# EAGLE design due_alternative (EAGLE 9.6.2)
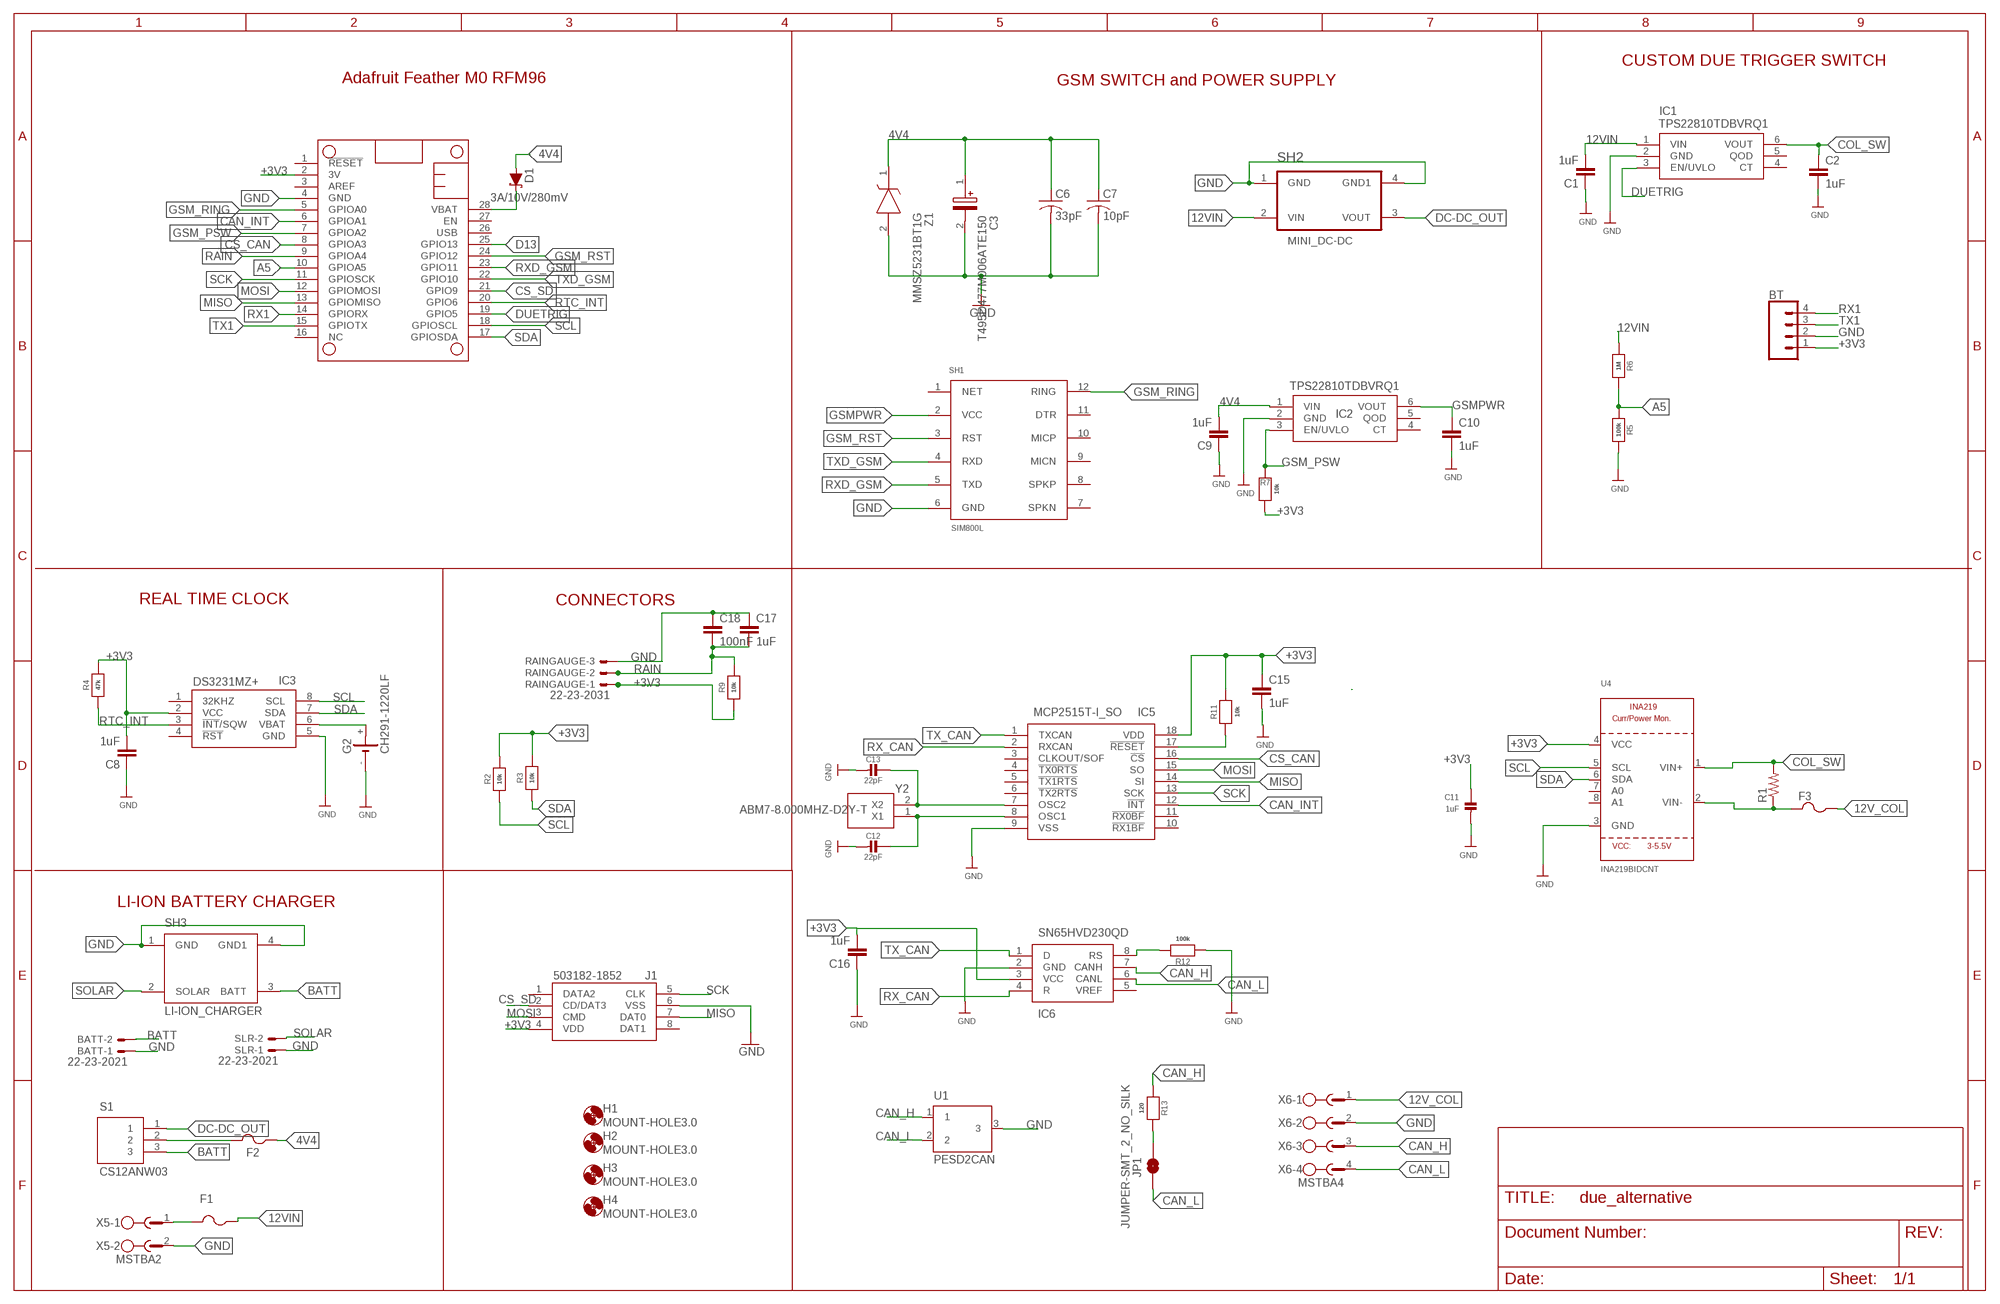
[diagram p0: schematic, sheet 1]

## Parts
BATT  22-23-2021  [22-23-2021]
BT  CONN_04PTH  [1X04]
C1  1uF  CC0603  [C0603]
C2  1uF  CC0603  [C0603]
C3  T495D477M006ATE150  [CAPPM7343X310N]
C6  33pF  C-USC0603  [C0603]
C7  10pF  C-USC0603  [C0603]
C8  1uF  CC0603  [C0603]
C9  1uF  CC0603  [C0603]
C10  1uF  CC0603  [C0603]
C11  1uF  CAP_CERAMIC0603_NO  [0603-NO]
C12  22pF  CAP_CERAMIC0603_NO  [0603-NO]
C13  22pF  CAP_CERAMIC0603_NO  [0603-NO]
C15  1uF  CC0603  [C0603]
C16  1uF  CC0603  [C0603]
C17  1uF  CC0603  [C0603]
C18  100nF  CC0603  [C0603]
D1  3A/10V/280mV  DIODE-SCHOTTKY-BAT60A  [SOD-323]
F1  PTCFUSE-1206  [R1206]
F2  PTCFUSE-1206  [R1206]
F3  PTCFUSE-1206  [R1206]
G2  CH291-1220LF  [CH291-1220LF]
H1  MOUNT-HOLE3.0  [3,0]
H2  MOUNT-HOLE3.0  [3,0]
H3  MOUNT-HOLE3.0  [3,0]
H4  MOUNT-HOLE3.0  [3,0]
IC1  TPS22810TDBVRQ1  [SOT95P280X145-6N]
IC2  TPS22810TDBVRQ1  [SOT95P280X145-6N]
IC3  DS3231MZ+  [SOIC127P600X175-8N]
IC5  MCP2515T-I_SO  [SOIC127P1030X265-18N]
IC6  SN65HVD230QD  [SOIC127P600X175-8N]
J1  503182-1852  [5031821852]
JP1  JUMPER-SMT_2_NO_SILK  [SMT-JUMPER_2_NO_SILK]
MS1  FEATHERWING_NODIM  [FEATHERWING_DIM]
R1  R-US_R6332  [R6332]
R2  10k  RESISTOR_0603_NOOUT  [0603-NO]
R3  10k  RESISTOR_0603_NOOUT  [0603-NO]
R4  47k  RESISTOR_0603_NOOUT  [0603-NO]
R5  100k  RESISTOR_0603_NOOUT  [0603-NO]
R6  1M  RESISTOR_0603_NOOUT  [0603-NO]
R7  10k  RESISTOR_0603_NOOUT  [0603-NO]
R9  10k  RESISTOR_0603_NOOUT  [0603-NO]
R11  10k  RESISTOR_0603_NOOUT  [0603-NO]
R12  100k  RESISTOR_0603_NOOUT  [0603-NO]
R13  120  RESISTOR_0603_NOOUT  [0603-NO]
RAINGAUGE  22-23-2031  [22-23-2031]
S1  CS12ANW03  [CS12ANW03]
SH1  SIM800L  [GSM_SIM800L]
SH2  MINI_DC-DC  [MINI_DC-DC_MP2307DN]
SH3  LI-ION_CHARGER  [LI-ION_CHARGER]
SLR  22-23-2021  [22-23-2021]
U1  PESD2CAN  [SOT23]
U4  INA219BIDCNT  INA219  [SOT23-8]
X5  MSTBA2  [MSTBA2]
X6  MSTBA4  [MSTBA4]
Y2  ABM7-8.000MHZ-D2Y-T  [ABM78000MHZD2YT]
Z1  MMSZ5231BT1G  [SOD3716X135N]

## Nets
4V4: C3.1(+) C6.1 C7.1 C9.2 D1.A F2.1 IC2.1(VIN) Z1.1(K)
12V_COL: F3.1 X6.1
12VIN: C1.2 F1.1 IC1.1(VIN) R6.1 SH2.2(VIN)
+3V3: BT.1 C8.2 C11.1 C15.1 C16.2 IC3.2(VCC) IC5.18(VDD) IC6.3(VCC) J1.4(VDD) MS1.2(3V) R2.2 R3.2 R4.2 R7.1 R9.1 R11.2 RAINGAUGE.1 U4.4(VCC)
A5: MS1.10(GPIOA5) R5.1 R6.2
BATT: BATT.2 S1.3 SH3.3(BATT)
CAN_H: IC6.7(CANH) R13.1 U1.1 X6.3
CAN_INT: IC5.12(!INT) MS1.6(GPIOA1)
CAN_L: IC6.6(CANL) JP1.1 U1.2 X6.4
COL_SW: C2.1 IC1.6(VOUT) R1.2 U4.1(VIN+)
CS_CAN: IC5.16(!CS) MS1.8(GPIOA3)
CS_SD: J1.2(CD/DAT3) MS1.21(GPIO9)
D13: MS1.25(GPIO13)
DC-DC_OUT: S1.1 SH2.3(VOUT)
DUETRIG: IC1.3(EN/UVLO) MS1.19(GPIO5)
GND: BATT.1 BT.2 C1.1 C2.2 C3.2(-) C6.2 C7.2 C8.1 C9.1 C10.2 C11.2 C12.2 C13.2 C15.2 C16.1 C17.1 C18.1 G2.- IC1.2(GND) IC2.2(GND) IC3.5(GND) IC5.9(VSS) IC6.2(GND) J1.6(VSS) MS1.4(GND) R5.2 R12.1 RAINGAUGE.3 SH1.6(GND) SH2.1(GND) SH2.4(GND1) SH3.1(GND) SH3.4(GND1) SLR.1 U1.3 U4.3(GND) X5.2 X6.2 Z1.2(A)
GSM_PSW: IC2.3(EN/UVLO) MS1.7(GPIOA2) R7.2
GSM_RING: MS1.5(GPIOA0) SH1.12(RING)
GSM_RST: MS1.24(GPIO12) SH1.3(RST)
GSMPWR: C10.1 IC2.6(VOUT) SH1.2(VCC)
MISO: IC5.14(SI) J1.7(DAT0) MS1.13(GPIOMISO)
MOSI: IC5.15(SO) J1.3(CMD) MS1.12(GPIOMOSI)
N$1: C12.1 IC5.8(OSC1) Y2.1(X1)
N$2: G2.+ IC3.6(VBAT)
N$3: C13.1 IC5.7(OSC2) Y2.2(X2)
N$4: F1.2 X5.1
N$7: IC6.8(RS) R12.2
N$8: F3.2 R1.1 U4.2(VIN-)
N$10: IC5.17(!RESET) R11.1
N$11: JP1.2 R13.2
N$16: F2.2 S1.2
RAIN: C17.2 C18.2 MS1.9(GPIOA4) R9.2 RAINGAUGE.2
RTC_INT: IC3.3(!INT!/SQW) MS1.20(GPIO6) R4.1
RX1: BT.4 MS1.14(GPIORX)
RX_CAN: IC5.2(RXCAN) IC6.4(R)
RXD_GSM: MS1.23(GPIO11) SH1.5(TXD)
SCK: IC5.13(SCK) J1.5(CLK) MS1.11(GPIOSCK)
SCL: IC3.8(SCL) MS1.18(GPIOSCL) R2.1 U4.5(SCL)
SDA: IC3.7(SDA) MS1.17(GPIOSDA) R3.1 U4.6(SDA)
SOLAR: SH3.2(SOLAR) SLR.2
TX1: BT.3 MS1.15(GPIOTX)
TX_CAN: IC5.1(TXCAN) IC6.1(D)
TXD_GSM: MS1.22(GPIO10) SH1.4(RXD)
VBAT: D1.C MS1.28(VBAT)
Unconnected: IC1.4(CT) IC1.5(QOD) IC2.4(CT) IC2.5(QOD) IC3.1(32KHZ) IC3.4(!RST) IC5.3(CLKOUT/SOF) IC5.4(!TX0RTS) IC5.5(!TX1RTS) IC5.6(!TX2RTS) IC5.10(!RX1BF) IC5.11(!RX0BF) IC6.5(VREF) J1.1(DATA2) J1.8(DAT1) MS1.1(!RESET) MS1.3(AREF) MS1.16(NC) MS1.26(USB) MS1.27(EN) SH1.1(NET) SH1.7(SPKN) SH1.8(SPKP) SH1.9(MICN) SH1.10(MICP) SH1.11(DTR) U4.7(A0) U4.8(A1)

## Notes on the sheet
- CUSTOM DUE TRIGGER SWITCH
- Adafruit Feather M0 RFM96 | GSM SWITCH and POWER SUPPLY
- REAL TIME CLOCK | CONNECTORS
- LI-ION BATTERY CHARGER

## Library data of the parts
BATT SLR = con-molex:22-23-2021: .100" (2.54mm) Center Header - 2 Pin; MF: MOLEX; MPN: 22-23-2021; OC_FARNELL: 1462926; OC_NEWARK: 25C3832
BT = SparkFun-Connectors:CONN_04: Multi connection point. Often used as Generic Header-pin footprint for 0.1 inch spaced/style header connections On any of the 0.1 inch spaced packages, you can populate with these: Break Away Headers - Straight <https://www.sparkfun.com/products/116> (PRT-00116) Break Away Male Headers - Right Angle <https://www.sparkfun.com/products/553> (PRT-00553) Female Headers <https://www.sparkfun.com/products/115> (PRT-00115) Break Away Headers - Machine Pin <https://www.sparkfun.com/products/117> (PRT-00117) Break Away Female Headers - Swiss Machine Pin <https://www.sparkfun.com/products/743> (PRT-00743) For SCREWTERMINALS and SPRING TERMINALS visit here: Screw Terimnals on SparkFun.com <https://www.sparkfun.com/search/results?term=Screw+Terminals> (5mm/3.5mm/2.54mm spacing) This device is also useful as a general connection point to wire up your design to another part of your project. Our various solder wires solder well into these plated through hole pads. Hook-Up Wire - Assortment (Stranded, 22 AWG) <https://www.sparkfun.com/products/11375> (PRT-11375) Hook-Up Wire - Assortment (Solid Core, 22 AWG) <https://www.sparkfun.com/products/11367> (PRT-11367) View the entire wire category on our website here <https://www.sparkfun.com/categories/141> Special notes: Molex polarized connector foot print use with SKU : PRT-08231 with associated crimp pins and housings. 1MM SMD Version SKU: PRT-10208; PROD_ID: CONN-09696
C1 C2 C8-C10 C15-C18 = eagle-ltspice:C: CAPACITOR, European symbol; SPICEMODEL: NONE; SPICEPREFIX: C
C3 = SamacSys_Parts:T495D477M006ATE150: Tantalum Capacitors - Solid SMD 6.3volts 470uF 20% Source: Datasheet <https://componentsearchengine.com/Datasheets/1/T495D477M006ATE150.pdf>; DESCRIPTION: Tantalum Capacitors - Solid SMD 6.3volts 470uF 20%; HEIGHT: 3.1mm; MANUFACTURER_NAME: Kemet; MANUFACTURER_PART_NUMBER: T495D477M006ATE150; MOUSER_PART_NUMBER: 80-T495D477M6ATE150; MOUSER_PRICE-STOCK: https://www.mouser.com/Search/Refine.aspx?Keyword=80-T495D477M6ATE150
C6 C7 = rcl:C-US: CAPACITOR, American symbol; SPICEPREFIX: C
C11-C13 = microbuilder:CAP_CERAMIC: Ceramic Capacitors For new designs, use the packages preceded by an '_' character since they are more reliable: The following footprints should be used on most boards: _0402 - Standard footprint for regular board layouts _0603 - Standard footprint for regular board layouts _0805 - Standard footprint for regular board layouts _1206 - Standard footprint for regular board layouts For extremely tight-pitch boards where space is at a premium, the following 'micro-pitch' footprints can be used (smaller pads, no silkscreen outline, etc.): _0402MP - Micro-pitch footprint for very dense/compact boards _0603MP - Micro-pitch footprint for very dense/compact boards _0805MP - Micro-pitch footprint for very dense/compact boards _1206MP - Micro-pitch footprint for very dense/compact boards
D1 = SparkFun-DiscreteSemi:DIODE-SCHOTTKY: Schottky diode A Schottky diode is a semiconductor diode which has a low forward voltage drop and a very fast switching action.; PROD_ID: DIO-14072
F1-F3 = adafruit:PTCFUSE: PTC fuses, resettable thermistors
G2 = battery:CH291-1220LF: Battery Holder, SMT, 12mm multicomp PART NO. CH291-1220LF Source: Data sheet <http://www.farnell.com/datasheets/1505860.pdf>
H1-H4 = holes:MOUNT-HOLE: MOUNTING HOLE with drill center marker
IC1 IC2 = TPS22810TDBVRQ1:TPS22810TDBVRQ1: Automotive 18V, 2A, 79m Load Switch With Adjustable Rise Time and Adjustable Quick Output Discharge Source: Datasheet <http://www.ti.com/lit/gpn/tps22810-q1>; DESCRIPTION: Automotive 18V, 2A, 79m Load Switch With Adjustable Rise Time and Adjustable Quick Output Discharge; HEIGHT: 1.45mm; MANUFACTURER_NAME: Texas Instruments; MANUFACTURER_PART_NUMBER: TPS22810TDBVRQ1
IC3 = DS3231MZ+:DS3231MZ+: Real Time Clock 5+/-ppm RTC Source: Datasheet <http://uk.rs-online.com/web/p/products/1897249>; DESCRIPTION: Real Time Clock 5+/-ppm RTC; HEIGHT: 1.75mm; MANUFACTURER_NAME: Maxim Integrated; MANUFACTURER_PART_NUMBER: DS3231MZ+; RS_PART_NUMBER: 1897249; RS_PRICE-STOCK: http://uk.rs-online.com/web/p/products/1897249
IC5 = SamacSys_Parts:MCP2515T-I_SO: Microchip Technology MCP2515T-I/SO, CAN Controller 1Mbit/s, 18-Pin SOIC Source: Datasheet <http://ww1.microchip.com/downloads/en/devicedoc/20001801h.pdf>; DESCRIPTION: Microchip Technology MCP2515T-I/SO, CAN Controller 1Mbit/s, 18-Pin SOIC; HEIGHT: 2.65mm; MANUFACTURER_NAME: Microchip; MANUFACTURER_PART_NUMBER: MCP2515T-I/SO; MOUSER_PART_NUMBER: 579-MCP2515T-I/SO; MOUSER_PRICE-STOCK: https://www.mouser.co.uk/ProductDetail/Microchip-Technology/MCP2515T-I-SO?qs=uMUszenkLLKzXVzy0vTLgQ%3D%3D
IC6 = SamacSys_Parts:SN65HVD230QD: 3.3-V CAN Transceiver with Standby Mode Source: Datasheet <https://www.ti.com/lit/ds/symlink/sn65hvd230q-q1.pdf>; ARROW_PART_NUMBER: SN65HVD230QD; ARROW_PRICE-STOCK: https://www.arrow.com/en/products/sn65hvd230qd/texas-instruments; DESCRIPTION: 3.3-V CAN Transceiver with Standby Mode; HEIGHT: 1.75mm; MANUFACTURER_NAME: Texas Instruments; MANUFACTURER_PART_NUMBER: SN65HVD230QD; MOUSER_PART_NUMBER: 595-SN65HVD230QD; MOUSER_PRICE-STOCK: https://www.mouser.co.uk/ProductDetail/Texas-Instruments/SN65HVD230QD/?qs=QViXGNcIEAuXYMZ2FIjwBA%3D%3D
J1 = SamacSys_Parts:503182-1852: Micro SD Normal UltraLowPro8CktEmbsTpPkg Source: Datasheet <https://www.molex.com/pdm_docs/sd/5031821852_sd.pdf>; DESCRIPTION: Micro SD Normal UltraLowPro8CktEmbsTpPkg; HEIGHT: mm; MANUFACTURER_NAME: Molex; MANUFACTURER_PART_NUMBER: 503182-1852; MOUSER_PART_NUMBER: 538-503182-1852; MOUSER_PRICE-STOCK: https://www.mouser.co.uk/ProductDetail/Molex/503182-1852?qs=s7UCm7gO1bZmpyAhCKZ26g%3D%3D
JP1 = SparkFun-Jumpers:JUMPER-SMT_2_NO: Normally open jumper This jumper has two pads in close proximity to each other. Apply solder to close the connection. Round pads are easier to solder for beginners, but are a lot larger. SparkFun Product that uses the round pads: SparkFun EL Sequencer <https://www.sparkfun.com/products/12781>
MS1 = adafruit:FEATHERWING
R1 = adafruit:R-US_: RESISTOR, American symbol
R2-R7 R9 R11-R13 = microbuilder:RESISTOR: Resistors For new designs, use the packages preceded by an '_' character since they are more reliable: The following footprints should be used on most boards: _0402 - Standard footprint for regular board layouts _0603 - Standard footprint for regular board layouts _0805 - Standard footprint for regular board layouts _1206 - Standard footprint for regular board layouts For extremely tight-pitch boards where space is at a premium, the following 'micro-pitch' footprints can be used (smaller pads, no silkscreen outline, etc.): _0402MP - Micro-pitch footprint for very dense/compact boards _0603MP - Micro-pitch footprint for very dense/compact boards _0805MP - Micro-pitch footprint for very dense/compact boards _1206MP - Micro-pitch footprint for very dense/compact boards
RAINGAUGE = con-molex:22-23-2031: .100" (2.54mm) Center Header - 3 Pin; MF: MOLEX; MPN: 22-23-2031; OC_FARNELL: 1462950; OC_NEWARK: 30C0862
S1 = SamacSys_Parts:CS12ANW03: NKK SWITCHES - CS12ANW03 - SWITCH, SLIDE, SPDT, 3A, 250V, TH Source: Datasheet <http://www.nkkswitches.com/pdf/cs.pdf>; ARROW_PART_NUMBER: CS12ANW03; ARROW_PRICE-STOCK: https://www.arrow.com/en/products/cs12anw03/nkk-switches; DESCRIPTION: NKK SWITCHES - CS12ANW03 - SWITCH, SLIDE, SPDT, 3A, 250V, TH; HEIGHT: mm; MANUFACTURER_NAME: NKK Switches; MANUFACTURER_PART_NUMBER: CS12ANW03; MOUSER_PART_NUMBER: 633-CS12ANW03; MOUSER_PRICE-STOCK: https://www.mouser.co.uk/ProductDetail/NKK-Switches/CS12ANW03?qs=4P1McwaGddbVHu%252BBZT0egw%3D%3D
SH1 = gsm_shield:SIM800L
SH2 = DC-DC converters:MINI_DC-DC
SH3 = Li-Ion_chargers:LI-ION_CHARGER
U1 = PESD2CAN:PESD2CAN
U4 = microbuilder:INA219: INA219 - I2C Current/Power Monitor Voltage Range: 0-26V Accuracy: 0.5% Temperature: -40°C - 125°C; MPN: INA219BIDCNT; OC_NEWARK: 28X4259
X5 = con-phoenix-508:MSTBA2: PHOENIX; MF: FARNELL; MPN: 1757242; OC_FARNELL: 3705171; OC_NEWARK: 71C4161
X6 = con-phoenix-508:MSTBA4: PHOENIX; MF: FARNELL; MPN: 1757268; OC_FARNELL: 3705195; OC_NEWARK: 71C4163
Y2 = SamacSys_Parts:ABM7-8.000MHZ-D2Y-T: ABRACON - ABM7-8.000MHZ-D2Y-T - CRYSTAL, 8MHZ, 18PF, SMD Source: Datasheet <http://www.abracon.com/Resonators/abm7.pdf>; DESCRIPTION: ABRACON - ABM7-8.000MHZ-D2Y-T - CRYSTAL, 8MHZ, 18PF, SMD; HEIGHT: 1.4mm; MANUFACTURER_NAME: ABRACON; MANUFACTURER_PART_NUMBER: ABM7-8.000MHZ-D2Y-T; MOUSER_PART_NUMBER: 815-ABM7-8-D2Y-T; MOUSER_PRICE-STOCK: https://www.mouser.co.uk/ProductDetail/ABRACON/ABM7-8000MHZ-D2Y-T?qs=LoTOQoUkC8SFsmY8snleBA%3D%3D
Z1 = SamacSys_Parts:MMSZ5231BT1G: 5.1V Zener diode,MMSZ5231B 500mW ON Semiconductor MMSZ5231BT1G Zener Diode, 5.1V 5% 0.5 W SMT 2-Pin SOD-123 Source: Datasheet <http://uk.rs-online.com/web/p/products/5453049P>; ALLIED_NUMBER: 70099546; DESCRIPTION: 5.1V Zener diode,MMSZ5231B 500mW ON Semiconductor MMSZ5231BT1G Zener Diode, 5.1V 5% 0.5 W SMT 2-Pin SOD-123; HEIGHT: 1.35mm; MANUFACTURER_NAME: ON Semiconductor; MANUFACTURER_PART_NUMBER: MMSZ5231BT1G; RS_PART_NUMBER: 5453049P

## Board
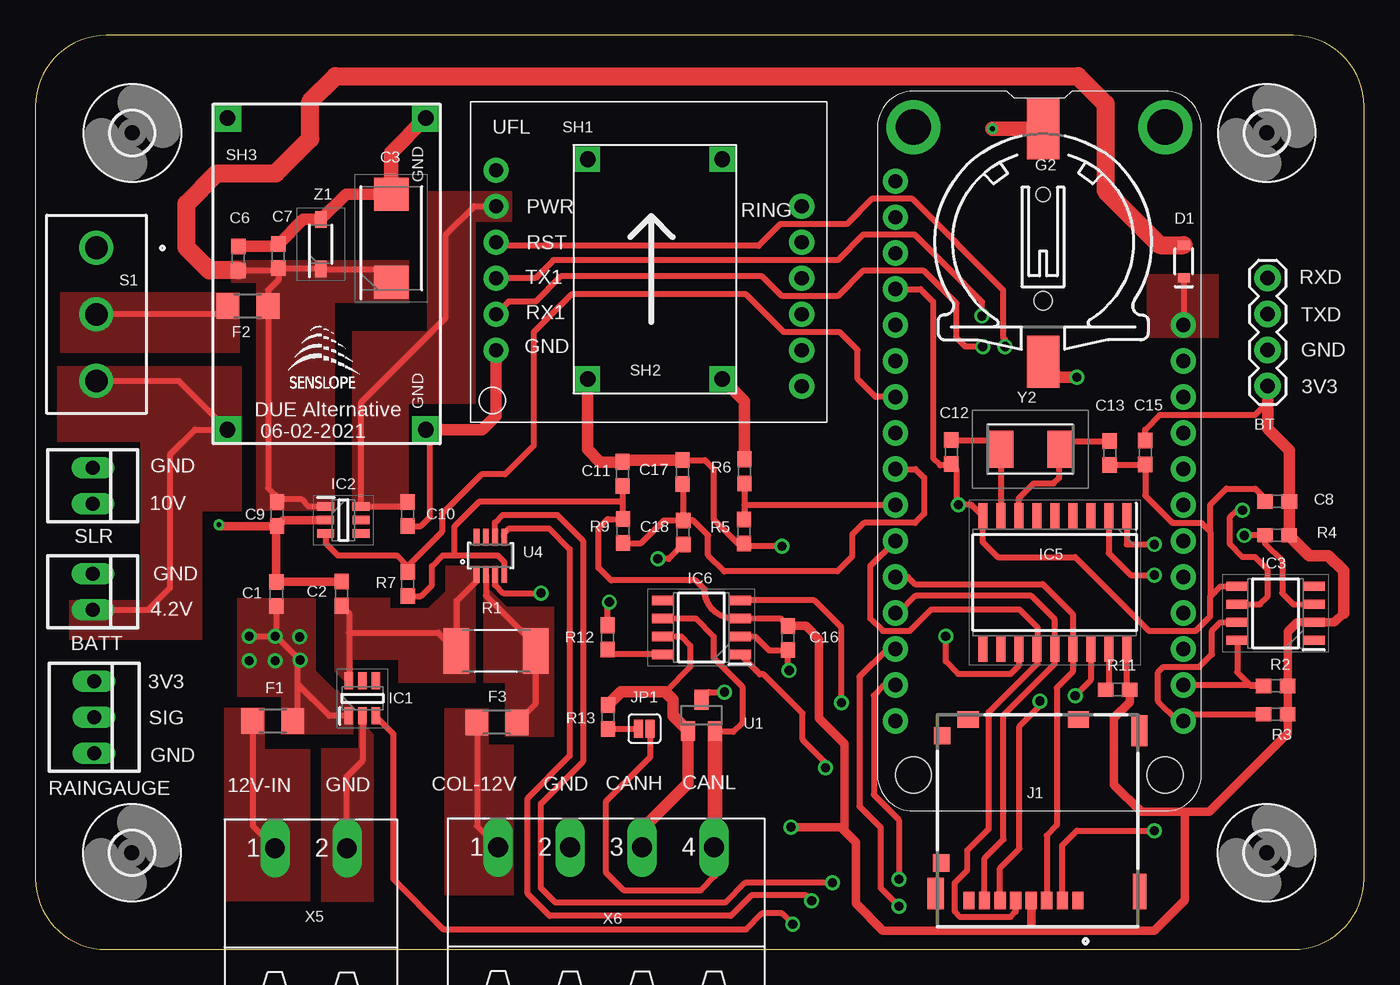
[diagram p1: board, top side]
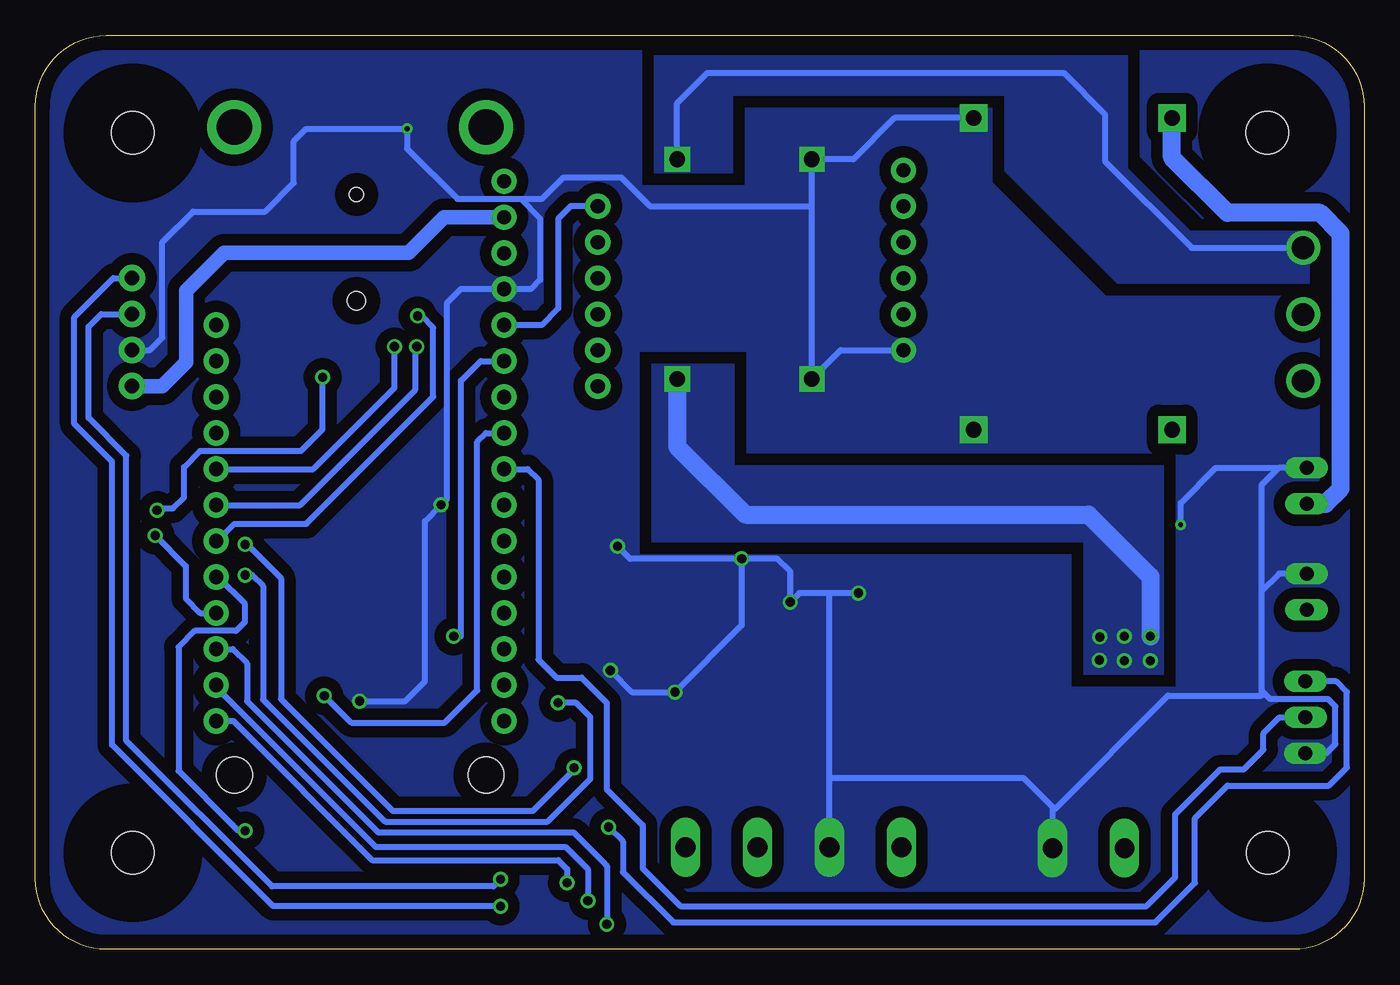
[diagram p2: board, bottom side, seen from below]

Size 93.8 x 64.5 mm. Coordinates in mm from the lower left corner, seen from the top.
Outline: 0,59.5 0,5 arc90 5,0 88.8,0 arc90 93.8,5 93.8,59.5 arc90 88.8,64.5 5,64.5 arc90 0,59.5
Copper layers (1*16): Top 0.035mm / dielectric 1.5mm / Bottom 0.035mm
Design rules "default *": minimum track width 8mil, minimum drill 0.35mm, track to track 6mil, track to pad 6mil, pad to pad 6mil, via to via 6mil, smd to smd 6mil, copper to edge 40mil, drill to drill 6mil, minimum pad ring 10mil, minimum via ring 8mil, stop-mask expansion 4mil, vias tented up to drill 0mil, thermal gap 10mil

### Footprints (pad centres in the part's own frame; a part is rotated, then mirrored left to right if it is on the bottom)
22-23-2021 = drill 1 long: 1 -1.27,0; 2 1.27,0
1X04 = drill 1.016 pad 1.88: 1 0,0; 2 2.54,0; 3 5.08,0; 4 7.62,0
C0603 = smd 1.1 x 1: 1 -0.85,0; 2 0.85,0
CAPPM7343X310N = smd 2.35 x 2.45: 1 -3.1,0; 2 3.1,0
0603-NO = smd 1.1 x 1: 1 -0.85,0; 2 0.85,0
SOD-323 = smd 0.63 x 0.83: A 1.15,0; C -1.15,0
R1206 = smd 1.6 x 1.803: 1 -1.422,0; 2 1.422,0
CH291-1220LF = smd 2.3 x 3.66: + 0,-2.296 | smd 2.3 x 4.3: - 0,14.146 | hole 1.3: 0,2 | hole 1: 0,9.5
3,0 = hole 3: 0,0
SOT95P280X145-6N = smd 1.2 x 0.6: 1 -1.25,0.95; 2 -1.25,0; 3 -1.25,-0.95; 4 1.25,-0.95; 5 1.25,0; 6 1.25,0.95
SOIC127P600X175-8N = smd 1.525 x 0.65: 1 -2.712,1.905; 2 -2.712,0.635; 3 -2.712,-0.635; 4 -2.712,-1.905; 5 2.712,-1.905; 6 2.712,-0.635; 7 2.712,0.635; 8 2.712,1.905
SOIC127P1030X265-18N = smd 1.85 x 0.65: 1 -4.675,5.08; 2 -4.675,3.81; 3 -4.675,2.54; 4 -4.675,1.27; 5 -4.675,0; 6 -4.675,-1.27; 7 -4.675,-2.54; 8 -4.675,-3.81; 9 -4.675,-5.08; 10 4.675,-5.08; 11 4.675,-3.81; 12 4.675,-2.54; 13 4.675,-1.27; 14 4.675,0; 15 4.675,1.27; 16 4.675,2.54; 17 4.675,3.81; 18 4.675,5.08
SOIC127P600X175-8N' = smd 1.55 x 0.7: 1 -2.725,1.905; 2 -2.725,0.635; 3 -2.725,-0.635; 4 -2.725,-1.905; 5 2.725,-1.905; 6 2.725,-0.635; 7 2.725,0.635; 8 2.725,1.905
5031821852 = smd 0.8 x 1.24: 1 -2.85,0.63; 2 -1.75,0.63; 3 -0.65,0.63; 4 0.45,0.63; 5 1.55,0.63; 6 2.65,0.63; 7 3.75,0.63; 8 4.85,0.63 | smd 0.95 x 2.5: 9 -7.195,0 | smd 1.15 x 2.2: 10 7.195,0.15; 15 -7.195,-11.33 | smd 1.16 x 1.25: 11 6.795,-2 | smd 1.16 x 1.2: 12 6.74,-11 | smd 1.5 x 1.15: 13 4.89,-12.125; 14 -2.89,-12.125
SMT-JUMPER_2_NO_SILK = smd 0.635 x 1.27: 1 -0.406,0; 2 0.406,0
FEATHERWING_DIM = drill 1 pad 1.778: 1 6.35,1.27; 2 8.89,1.27; 3 11.43,1.27; 4 13.97,1.27; 5 16.51,1.27; 6 19.05,1.27; 7 21.59,1.27; 8 24.13,1.27; 9 26.67,1.27; 10 29.21,1.27; 11 31.75,1.27; 12 34.29,1.27; 13 36.83,1.27; 14 39.37,1.27; 15 41.91,1.27; 16 44.45,1.27; 17 44.45,21.59; 18 41.91,21.59; 19 39.37,21.59; 20 36.83,21.59; 21 34.29,21.59; 22 31.75,21.59; 23 29.21,21.59; 24 26.67,21.59; 25 24.13,21.59; 26 21.59,21.59; 27 19.05,21.59; 28 16.51,21.59 | drill 2.5 pad 3.81: P$1 2.54,20.32; P$2 2.54,2.54 | hole 2.54: 48.26,20.32; 48.26,2.54
R6332 = smd 1.8 x 3.2: 1 -2.8,0; 2 2.8,0
22-23-2031 = drill 1 long: 1 -2.54,0; 2 0,0; 3 2.54,0
CS12ANW03 = drill 1.6 pad 2.37: 1 0,-4.7; 2 0,0; 3 0,4.7
GSM_SIM800L = drill 1 pad 1.778: 1 0,0; 2 0,-2.54; 3 0,-5.08; 4 0,-7.62; 5 0,-10.16; 6 0,-12.7; 7 21.59,-15.24; 8 21.59,-12.7; 9 21.59,-10.16; 10 21.59,-7.62; 11 21.59,-5.08; 12 21.59,-2.54
MINI_DC-DC_MP2307DN = drill 1.1 pad 1.778 square: 1 0,0; 2 0,-9.5; 3 15.5,-9.5; 4 15.5,0
LI-ION_CHARGER = drill 1.1 pad 1.93 square: 1 0,0; 2 0,-14; 3 22,-14; 4 22,0
SOT23 = smd 1 x 1.4: 1 -0.95,-1.1; 2 0.95,-1.1; 3 0,1.1
SOT23-8 = smd 0.4 x 1.2: 1 -0.975,-1.3; 2 -0.325,-1.3; 3 0.325,-1.3; 4 0.975,-1.3; 5 0.975,1.3; 6 0.325,1.3; 7 -0.325,1.3; 8 -0.975,1.3
MSTBA2 = drill 1.397 long: 1 -2.54,5.08; 2 2.54,5.08
MSTBA4 = drill 1.397 long: 1 -7.62,5.08; 2 -2.54,5.08; 3 2.54,5.08; 4 7.62,5.08
ABM78000MHZD2YT = smd 1.9 x 2.6: 1 -2.15,0; 2 2.15,0
SOD3716X135N = smd 1.15 x 0.8: 1 -1.75,0; 2 1.75,0

### Placement (x,y rotation side)
BATT  4.05,25.25 270 top
BT  87,39.75 90 top
C1  17.01,25.08 270 top
C2  21.62,25.1 90 top
C3  25.12,50.19 90 top
C6  14.33,48.76 90 top
C7  17.16,48.92 90 top
C8  87.67,31.61 0 top
C9  17.07,30.73 90 top
C10  26.27,30.72 270 top
C11  41.45,33.56 90 top
C12  64.65,35.09 270 top
C13  75.84,35.02 270 top
C15  78.34,35.06 270 top
C16  53.13,21.98 90 top
C17  45.69,33.68 270 top
C18  45.73,29.43 90 top
D1  81.07,48.55 90 top
F1  16.76,16.13 180 top
F2  15.01,45.42 180 top
F3  32.59,16.02 0 top
G2  71.14,43.77 0 top
H1  6.81,6.82 0 top
H2  86.92,6.82 0 top
H3  86.93,57.62 0 top
H4  6.84,57.62 0 top
IC1  23.09,17.72 90 top
IC2  21.74,30.29 0 top
IC3  87.55,23.72 180 top
IC5  71.96,25.89 270 top
IC6  SN65HVD230QD  [SOIC127P600X175-8N']  47.01,22.72 180 top
J1  70.75,4.09 180 top
JP1  43,15.57 180 top
MS1  59.44,60.57 270 top
R1  32.53,21.05 180 top
R2  87.55,18.59 0 top
R3  87.55,16.59 0 top
R4  87.65,29.22 0 top
R5  50.03,29.49 270 top
R6  50.06,33.74 270 top
R7  26.29,25.78 90 top
R9  41.49,29.52 270 top
R11  76.4,18.33 0 top
R12  40.38,22.02 270 top
R13  40.41,16.41 270 top
RAINGAUGE  4.14,16.38 270 top
S1  4.3,44.81 180 top
SH1  32.51,54.99 0 top
SH2  38.99,40.26 90 top
SH3  27.56,58.67 270 top
SLR  4.05,32.71 270 top
U1  47.03,16.52 0 top
U4  32.12,27.79 0 top
U$13  [LOGO_SML_TNAME]  20.14,41.21 0 top
X5  19.45,2.07 0 top
X6  40.29,2.13 0 top
Y2  70.23,35.31 0 top
Z1  20.14,49.76 90 top

### Tracks (layer width: path | path; a pad name or v marks a point on that pad's centre or on a via)
4V4
  Top 0.406: C6.1 17,47.91 C7.1 | C7.1 20.08,48.08 Z1.1 24.19,48.01 C3.1 | C7.1 17.16,47.26 16.43,46.53 F2.1 16.43,32.56 17.24,31.75 | IC2.1 19.3,31.24 18.8,31.75 17.24,31.75 | 17.24,31.75 C9.2
  Top 1.27: C6.1 12.28,47.91 10.67,49.53 10.67,52.63 12.8,54.76 16.97,54.76 19.41,57.2 19.41,59.84 21.18,61.62 73.61,61.62 75.54,59.69 75.54,53.54 79.38,49.7 D1.A
  pour Top (no thermals): 21.13,30.99 21.13,45.67 26.37,45.67 26.37,48.62 13.82,48.62 13.82,47.09 15.6,47.09 15.6,31.04 15.6,30.99
12V_COL
  Top 0.406: F3.1 31.16,8.72 X6.1
  pour Top (no thermals): 31.95,16.92 31.95,14.43 33.53,14.43 33.63,14.43 33.73,14.43 33.73,3.81 28.91,3.81 28.91,17.02 31.95,17.02
12VIN  (via drill 0.65)
  Top 0.406: C1.2 17.01,22.1 | v15.09,22.1 17.01,22.1 | IC1.1 20.76,16.47 18.49,18.75 | F1.1 18.49,15.82 18.49,18.75 | 17.01,22.1 18.49,20.61 18.49,18.75
  Top 0.813: SH2.2 50.06,38.69 R6.1
  Bottom 1.27: SH2.2 48.49,35.48 43.69,30.68 19.46,30.68 15.09,26.31 v15.09,22.1
  other vias: 16.92,22.1 18.64,22.05 18.69,20.42 16.92,20.37 15.09,20.37
  pour Top (no thermals): 22.4,17.17 22.4,15.19 17.37,15.19 17.37,17.83 14.27,17.83 14.27,24.79 19.76,24.79 19.76,19.66 21.13,18.29 21.29,18.29
  pour Bottom (no thermals): 14.12,19.41 14.12,34.14 44.45,34.14 44.45,41.3 50.29,41.3 50.29,28.75 19.81,28.75 19.81,19.41
+3V3  (via drill 0.65)
  Top 0.406: IC5.18 77.04,18.54 R11.2 | C15.1 78.34,36.69 79.38,37.72 86.11,37.72 87,38.61 BT.1 | C16.2 52.61,23.35 IC6.3 49.29,23.35 arc-90 47.24,25.4 46.61,26.04 40.64,26.04 39.75,26.92 39.75,29.72 40.4,30.37 R9.1 41.45,30.41 41.45,31.5 | C11.1 41.45,31.5 | R7.1 27.22,24.93 27.99,25.7 27.99,27.05 28.75,27.81 29.59,27.81 | U4.4 33.1,27.35 32.64,27.81 29.59,27.81 | 29.59,27.81 29.59,29.84 31.37,31.62 41.32,31.62 41.45,31.5
  Top 0.61: 81.13,9.72 82.87,9.72 88.4,15.25 R3.2 R2.2 88.4,22.41 89.07,23.08 IC3.2 91.71,23.08 92.35,23.72 | 81.13,9.72 78.06,9.72 76.15,11.63 76.15,16.36 77.25,17.46 R11.2 | 81.13,9.72 81.13,3.45 78.99,1.32 70.21,1.32 | 56.97,8.51 57.91,7.57 57.91,3.25 59.84,1.32 70.21,1.32 | 56.97,8.51 56.84,8.64 v53.34,8.64 | J1.4 70.3,1.41 70.21,1.32 | C16.2 54.38,22.84 55.32,21.89 55.32,16.31 57.1,14.53 57.1,8.64 56.97,8.51
  Top 0.813: BT.1 87,36.75 88.52,35.23 C8.2 88.52,29.24 R4.2 89.93,27.79 91.29,27.79 92.35,26.72 92.35,23.72
  Bottom 0.406: v53.34,8.64 52.32,7.62 52.32,5.46 48.77,1.91 14.73,1.91 11.94,4.7 11.94,9.27 9.65,11.56 2.49,11.56 1.22,12.83 1.22,18.16 1.98,18.92 RAINGAUGE.1
  Bottom 1.016: BT.1 84.86,39.75 83.16,41.45 83.16,46.48 80.47,49.17 67.46,49.17 64.96,51.68 MS1.2
A5
  Top 0.406: R6.2 50.06,31.37 | 50.06,31.37 50.06,30.38 R5.1 | MS1.10 50.07,31.36 50.06,31.37
BATT
  Top 0.406: BATT.2 7.97,23.98 9.49,25.5 9.49,34.9 11.27,36.67 SH3.3 10.12,40.12 S1.3
  pour Top (no thermals): 2.44,24.64 7.47,24.64 7.47,35.81 1.57,35.81 1.57,41.15 14.53,41.15 14.53,30.94 11.73,30.94 11.73,21.84 2.44,21.84
CAN_H
  Top 0.406: IC6.7 45.61,22.08 46.23,21.46 46.23,19.91 44.5,18.19 44.45,18.19
  Top 0.813: X6.3 42.83,8.49 46.08,11.74 U1.1 45.01,16.49 45.01,17.63 44.45,18.19 41.34,18.19 R13.1
CAN_INT  (via drill 0.65)
  Top 0.406: IC5.12 69.42,20.02 68.83,19.43 65.15,19.43 64.26,20.32 v64.26,22.1
  Bottom 0.406: v64.26,22.1 63.75,22.1 63.75,40.13 62.37,41.52 MS1.6
CAN_L
  Top 0.406: U1.2 47.91,15.35 49.26,15.35 49.91,16 49.91,18.54 47.88,20.57 47.88,22.1 46.62,23.35 IC6.6 | JP1.1 43.41,13.56 40.26,10.41 40.26,5.46 41.53,4.19 46.99,4.19 47.98,5.18 47.91,5.25 X6.4
  Top 1.016: U1.2 47.98,7.28 X6.4
COL_SW
  Top 0.406: U4.1 31.15,25.99 29.73,24.57 R1.2 28.43,22.35 22.14,22.35 | C2.1 22.14,23.73 22.14,22.35 | 22.14,22.35 IC1.6
  pour Top (no thermals): 21.13,24.79 21.13,19.66 21.84,18.95 22.4,18.95 22.4,20.47 25.65,20.47 25.65,18.85 31.09,18.85 31.09,27.03 28.96,27.03 28.96,25.25 27.74,24.03 25.04,24.03 25.04,24.79
CS_CAN  (via drill 0.65)
  Top 0.406: IC5.16 74.5,19 v73.41,17.91
  Bottom 0.406: v73.41,17.91 71.5,16 64.9,16 62.61,18.29 62.61,35.81 61.99,36.44 MS1.8
CS_SD  (via drill 0.65)
  Top 0.406: J1.2 72.5,7.34 73.53,8.38 v78.99,8.38
  Bottom 0.406: v78.99,8.38 79.48,8.38 79.87,8.77 83.69,12.59 83.69,21.34 82.55,22.48 79.63,22.48 78.99,23.11 78.99,24.38 80.89,26.28 MS1.21
DC-DC_OUT
  Bottom 0.406: SH2.3 48.49,59.72 46.35,61.85 21.21,61.85 18.29,58.93 18.29,55.63 12.18,49.52 S1.1
  pour Bottom (no thermals): 3.86,50.7 3.86,47.04 3.91,46.99 17.37,46.99 25.35,54.97 25.35,60.25 44.6,60.25 44.6,54.76 50.09,54.76 50.09,63.09 16.71,63.09 16.71,55.12 12.29,50.7
DUETRIG  (via drill 0.65)
  Top 0.406: v53.46,1.78 52.7,2.54 51.31,2.54 50.16,1.4 28.83,1.4 25.27,4.95 25.27,15.19 24.04,16.42 IC1.3
  Bottom 0.406: MS1.19 79.87,21.2 78.87,20.19 78.87,17.53 69.6,8.26 55.81,8.26 53.62,6.06 53.62,6.05 53.46,5.9 v53.46,1.78
GND  (via drill 0.35, 0.65)
  Top 0.406: C13.2 78.31,34.17 C15.2 78.34,32.02 80.26,30.1 82.3,30.1 82.93,29.46 | IC3.5 83.66,25.62 82.93,24.89 | 82.93,24.89 82.93,23.5 81.92,22.48 78.61,22.48 73.41,27.69 67.94,27.69 66.88,28.75 IC5.9 66.08,31.37 v65.15,31.37 65.03,31.49 65.03,33.86 C12.2 64.57,34.16 63.88,34.16 63.37,34.67 63.37,45.72 62.49,46.6 MS1.4 | 82.93,29.46 82.93,24.89 | 82.93,29.46 82.93,31.37 84.07,32.51 86.11,32.51 86.82,31.8 C8.1 | IC6.2 50.82,22.08 51.82,21.08 53.08,21.08 C16.1 53.09,21.09 53.09,19.81 v53.21,19.68 | J1.6 68.1,5.74 69.47,7.11 69.47,15.75 70.92,17.2 v70.92,17.53 | U1.3 47.57,18.16 v48.64,18.16 | IC1.2 23.09,13.3 21.95,12.15 21.95,8.37 21.99,8.33 X5.2 | U4.3 32.45,25.72 33.02,25.15 v35.69,25.15 | 21.6,25.93 C2.2 | C18.1 44.71,27.56 v43.94,27.56 | C17.1 47.26,34.53 47.88,33.91 47.88,30.35 49.59,28.64 R5.2 50.22,28.45 v52.7,28.45 | R12.1 40.38,24.38 v40.51,24.51 | C10.2 27.2,29.87 27.81,30.48 27.81,36.42 SH3.4
  Top 0.61: C2.2 17.02,25.95 C1.1 17.01,29.82 C9.1 | IC2.2 17.48,30.29 C9.1 | C9.1 13.05,29.88 v12.95,29.97
  Top 0.813: C6.2 17,49.61 C7.2 18.89,51.51 Z1.2 21.92,53.29 C3.2 | SH3.4 31.54,36.67 32.51,37.64 SH1.6 | SH2.1 38.99,35.28 39.88,34.39 41.43,34.39 C11.2 41.56,34.53 C17.1
  Top 1.016: G2.- v67.56,57.91 | C3.2 25.12,56.23 SH3.1
  Bottom 0.406: v70.92,17.53 67.69,17.53 66.29,18.92 66.29,30.23 v65.15,31.37 64.77,31.75 64.77,45.59 63.75,46.61 60.72,46.61 MS1.4 58.81,46.6 58.17,47.24 58.17,51.56 59.56,52.96 | v43.94,27.56 43.94,22.86 v48.64,18.16 51.69,18.16 v53.21,19.68 | v43.94,27.56 41.4,27.56 40.51,26.67 v40.51,24.51 39.88,25.15 37.85,25.15 | v35.69,25.15 37.85,25.15 | SH1.6 36.96,42.29 SH2.1 38.99,52.45 | 59.56,52.96 64.01,52.96 67.56,56.52 v67.56,57.91 74.68,57.91 75.56,57.02 75.56,54.1 77.6,52.07 82.68,52.07 84.84,49.91 84.84,43.18 85.72,42.29 BT.2 | X6.2 37.75,11.94 | 37.75,11.94 37.75,25.05 37.85,25.15 | 38.99,52.45 SH2.4 36.06,55.76 33.15,58.67 SH3.1 | 59.56,52.96 58.04,52.96 56.52,54.48 52.45,54.48 50.42,52.45 38.99,52.45 | RAINGAUGE.3 2.67,13.84 2.03,14.48 2.03,17.14 2.54,17.65 6.6,17.65 7.24,18.29 | BATT.1 6,26.52 7.24,25.27 | 7.24,25.27 7.24,18.29 | 7.24,18.29 7.24,17.91 13.84,17.91 21.84,9.91 21.97,10.03 | SLR.1 6.03,33.98 | 7.24,25.27 7.24,32.77 6.03,33.98 | X5.2 21.97,7.17 21.97,10.03 | 21.97,10.03 24,12.06 37.62,12.06 37.75,11.94 | v12.95,29.97 12.95,31.5 10.47,33.98 6.03,33.98 | v43.94,27.56 51.82,27.56 v52.7,28.45
  pour Top (no thermals): 22.81,16.97 22.81,14.48 22.81,14.17 20.17,14.17 20.17,3.4 23.88,3.4 23.88,15.14 23.42,15.6 23.37,15.65 23.37,16.97
  pour Bottom (isolate 0.813, rank 3, no thermals): 0,5 0,59.47 arc-90 5,64.47 88.78,64.47 arc-90 93.78,59.47 93.78,5 arc-90 88.78,0 5,0 arc-90
GSM_PSW
  Top 0.406: IC2.3 20.49,28.66 21.34,27.81 25.53,27.81 26.29,27.05 | 26.29,27.05 R7.2 | MS1.7 59.31,38.99 58.04,40.26 58.04,42.32 56.79,43.56 52.83,43.56 50.16,46.23 37.85,46.23 35.18,43.56 35.18,35.56 33.15,33.53 31.5,33.53 28.7,30.73 28.7,29.46 26.29,27.05
GSM_RING
  Bottom 0.406: SH1.12 56.01,52.45 56.9,51.56 56.9,45.21 58.05,44.06 MS1.5
GSM_RST  (via drill 0.65)
  Top 0.406: v68.45,42.55 68.45,43.05 68.33,43.18 68.33,46.53 61.9,52.96 59.05,52.96 57.28,51.18 52.58,51.18 51.05,49.66 32.77,49.66 SH1.3
  Bottom 0.406: MS1.24 74.18,33.9 68.45,39.62 v68.45,42.55
GSMPWR
  Top 0.406: C10.1 25.94,31.24 IC2.6 22.99,38.62 28.96,44.58 28.96,50.42 30.99,52.45 SH1.2
  pour Top (no thermals): 22.4,31.09 22.4,43.64 27.64,43.64 27.69,43.69 27.69,53.49 33.63,53.49 33.63,51.36 31.04,51.36 31.04,38.51 26.31,38.51 26.31,31.04 22.4,31.04
MISO
  Top 0.406: MS1.13 60.92,23.74 62.12,24.94 70.31,24.94 71.96,23.29 IC5.14 71.96,20.15 68.35,16.54 68.35,7.77 67,6.42 J1.7
MOSI
  Top 0.406: MS1.12 61.6,26.28 62.1,25.78 71.12,25.78 73.23,23.67 IC5.15 73.23,19.59 72.11,18.46 72.11,8.74 71.4,8.03 J1.3
N$1
  Top 0.406: IC5.8 68.15,35.23 Y2.1 67.44,35.94 C12.1
N$2  (via drill 0.65)
  Top 0.406: IC3.6 86.45,24.35 87,24.89 87,26.8 86.11,27.69 85.22,27.69 84.33,28.57 84.33,30.48 84.84,30.99 v85.22,30.99
  Top 0.813: v73.53,40.39 72.23,40.39 G2.+
  Bottom 0.406: v85.22,30.99 85.09,31.11 84.07,31.11 83.31,31.88 83.31,34.04 82.17,35.18 75.06,35.18 73.53,36.7 v73.53,40.39
N$3
  Top 0.406: IC5.7 69.42,31.83 70.48,32.89 71.88,32.89 72.25,33.27 72.25,35.18 Y2.2 72.95,35.87 C13.1
N$4
  Top 0.406: F1.2 15.34,8.71 X5.1
  pour Top (no thermals): 16.15,17.02 16.15,14.12 19.35,14.12 19.35,3.45 19.41,3.4 13.36,3.4 13.36,17.07 16.15,17.07
N$7
  Top 0.406: IC6.8 40.74,20.81 R12.2
N$8
  Top 0.406: F3.2 35.33,17.34 R1.1 35.33,21.44 31.8,24.97 U4.2
  pour Top (no thermals): 31.65,27.03 31.65,18.85 33.17,18.85 33.17,15.04 36.27,15.04 36.63,15.04 36.63,24.13 33.27,24.13 32.05,25.35 32,25.4 32,27.03
N$10
  Top 0.406: IC5.17 75.77,18.56 R11.1
N$11
  Top 0.406: R13.2 42.58,15.56 JP1.2
N$16
  Top 0.406: F2.2 12.98,44.81 S1.2
  pour Top (no thermals): 14.38,46.33 14.38,42.11 1.78,42.11 1.78,46.38 14.38,46.38
RAIN
  Top 0.406: C17.2 45.73,32.79 C18.2 | MS1.9 62.13,33.9 62.74,33.3 62.74,30.73 62.1,30.1 58.5,30.1 57.66,29.26 57.66,27.71 56.62,26.67 48.64,26.67 47.5,27.81 47.5,29.21 46.43,30.27 C18.2 | R9.2 42.76,28.67 44.37,30.27 C18.2
  Bottom 0.406: MS1.9 59.05,33.9 58.29,33.15 58.29,20.45 57.02,19.18 55.24,19.18 53.47,17.4 53.47,11.3 50.93,8.76 50.93,5.71 48.26,3.05 15.37,3.05 13.34,5.08 13.34,9.53 10.16,12.7 8.51,12.7 7.11,14.1 7.11,15.24 5.97,16.38 RAINGAUGE.2
RTC_INT  (via drill 0.65)
  Top 0.406: IC3.3 88.81,24.35 88.01,25.15 88.01,27.43 86.8,28.64 R4.1 85.35,29.22 v85.34,29.21
  Bottom 0.406: v85.34,29.21 83.19,27.05 83.19,24.77 82.16,23.74 MS1.20
RX1  (via drill 0.65)
  Top 0.406: MS1.14 60.14,21.2 58.17,19.23 58.17,10.11 59.67,8.61 59.67,4.34 v60.96,3.05
  Bottom 0.406: BT.4 88.31,47.37 91.06,44.62 91.06,37.08 88.39,34.42 88.39,14.44 77,3.05 v60.96,3.05
RX_CAN  (via drill 0.65)
  Top 0.406: IC5.2 75.77,27.97 77.33,26.42 v78.99,26.42 | v56.9,17.4 56.9,22.73 54.99,24.64 49.75,24.64 IC6.4
  Bottom 0.406: v78.99,26.42 78.49,26.42 77.72,25.65 77.72,17.64 69.11,9.02 57.64,9.02 54.61,12.05 54.61,16.38 55.63,17.4 v56.9,17.4
RXD_GSM  (via drill 0.65)
  Top 0.406: v66.88,42.55 65.66,42.55 65.02,43.18 65.02,45.59 62.74,47.88 58.42,47.88 56.64,46.1 52.7,46.1 51.31,47.5 37.08,47.5 35.31,45.72 33.4,45.72 SH1.5
  Bottom 0.406: MS1.23 75.1,31.36 67,39.46 67,42.42 v66.88,42.55
SCK
  Top 0.406: MS1.11 58.93,27.03 58.93,23.37 59.82,22.48 61.72,22.48 63.25,24 69.47,24 70.74,22.73 70.74,21.26 | 70.74,21.26 IC5.13 | J1.5 69.2,2.65 68.83,2.29 65.28,2.29 64.9,2.67 64.9,4.7 65.79,5.59 65.79,6.99 67.31,8.51 67.31,16.74 70.74,20.17 70.74,21.26
SCL  (via drill 0.65)
  Top 0.406: IC3.8 84.83,19.56 85.81,18.59 R2.1 86.63,18.66 MS1.18 | v54.8,3.43 54.42,3.81 50.55,3.81 49.1,2.36 36.31,2.36 34.75,3.93 34.75,10.68 37.72,13.65 37.72,28.25 36.25,29.72 33.45,29.72 33.1,29.36 U4.5
  Bottom 0.406: MS1.18 81.03,18.51 69.77,7.24 56.38,7.24 54.8,5.66 v54.8,3.43
SDA  (via drill 0.65)
  Top 0.406: R3.1 81.5,16.59 MS1.17 80.65,16.12 79.25,17.52 79.25,19.56 79.63,19.94 82.17,19.94 83.06,20.83 83.06,22.48 83.66,23.08 IC3.7 | U4.6 32.45,30.12 32.98,30.66 36.84,30.66 38.66,28.84 38.66,13.26 35.69,10.29 35.69,4.32 36.7,3.3 48.71,3.3 50.11,4.7 v56.26,4.7
  Bottom 0.406: MS1.17 79.85,16.12 70.03,6.3 56.9,6.3 56.26,5.66 v56.26,4.7
SOLAR
  Bottom 1.27: SLR.2 2.72,31.44 1.65,32.51 1.65,50.52 3.1,51.97 9.65,51.97 13.56,55.88 SH3.2
TX1  (via drill 0.65)
  Top 0.406: MS1.15 59.93,18.66 59.18,17.91 59.18,10.92 60.96,9.14 v60.96,4.95
  Bottom 0.406: v60.96,4.95 61.47,4.45 77.1,4.45 87.38,14.72 87.38,34.84 90.04,37.51 90.04,43.94 89.15,44.83 BT.3
TX_CAN  (via drill 0.65)
  Top 0.406: IC5.1 77.04,28.57 v78.99,28.57 | v55.78,12.83 55.78,13.18 54.15,14.81 54.15,16.66 51.4,19.41 51.13,19.41 IC6.1
  Bottom 0.406: v78.99,28.57 78.85,28.57 76.45,26.18 76.45,17.65 68.58,9.78 58.67,9.78 55.78,12.68 v55.78,12.83
TXD_GSM  (via drill 0.65)
  Top 0.406: v66.83,44.7 66.83,45.7 62.09,50.43 58.44,50.43 56.64,48.64 36.58,48.64 35.31,47.37 SH1.4
  Bottom 0.406: MS1.22 80.97,28.82 79.76,30.04 74.68,30.04 65.71,39.01 65.71,43.87 66.55,44.7 v66.83,44.7
VBAT
  Top 0.406: D1.C 81.07,44.1 MS1.28
  pour Top (no thermals): 78.49,47.65 83.46,47.65 83.46,43.18 78.49,43.18

### Text on the board
tNames: PWR | RING | RST | TX1 | RXD | RX1 | TXD | GND | GND | 3V3 | DUE Alternative / 06-02-2021 | GND | 10V | GND | 4.2V | 3V3 | SIG | GND | 12V-IN | GND | COL-12V | GND | CANH | CANL